# Altium project miniMMC_v2.PrjPcb
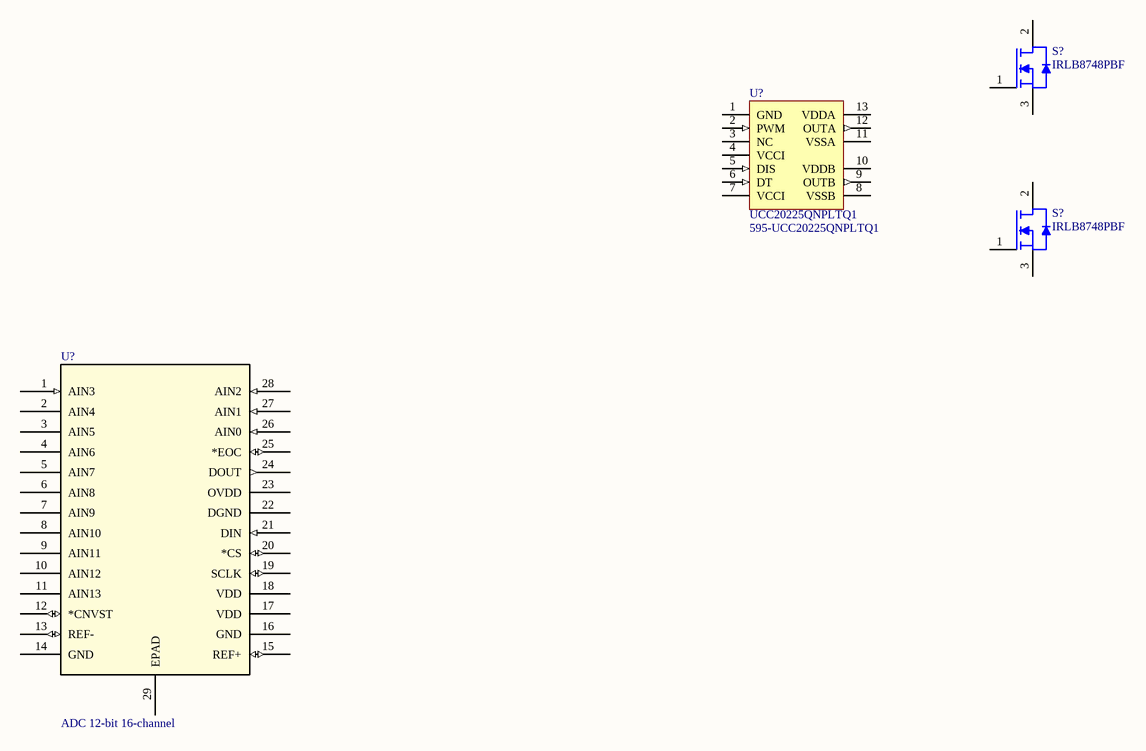
[diagram p0: SM.SchDoc]
1 sheet, 4 parts. Net scope: global (net labels, ports and power ports of the same name join across sheets).

## Sheet SM.SchDoc
size A4

### Parts
(Parts that share a designator on the sheet are numbered #1, #2 ... from top to bottom, then left to right.)
S?#1  IRLB8748PBF  [IRLB8748PBF]
S?#2  IRLB8748PBF  [IRLB8748PBF]
U?#1  UCC20225QNPLTQ1  Supplier Part Number 1: 595-UCC20225QNPLTQ1  [UCC20255-Q1]
U?#2  ADC 12-bit 16-channel  [21-0140L_T285500]

### Nets

Not connected (* = marked no-connect by the designer): S?#1 1 2 3; S?#2 1 2 3; U?#1 1(GND) 2(PWM) 3(NC) 4(VCCI) 5(DIS) 6(DT) 7(VCCI) 8(VSSB) 9(OUTB) 10(VDDB) 11(VSSA) 12(OUTA) 13(VDDA); U?#2 1(AIN3) 2(AIN4) 3(AIN5) 4(AIN6) 5(AIN7) 6(AIN8) 7(AIN9) 8(AIN10) 9(AIN11) 10(AIN12) 11(AIN13) 12(*CNVST) 13(REF-) 14(GND) 15(REF+) 16(GND) 17(VDD) 18(VDD) 19(SCLK) 20(*CS) 21(DIN) 22(DGND) 23(OVDD) 24(DOUT) 25(*EOC) 26(AIN0) 27(AIN1) 28(AIN2) 29(EPAD)

### Library data of the parts
S?#1 S?#2 = IRLB8748PBF: Trans MOSFET N-CH 30V 92A 3-Pin(3+Tab) TO-220AB Tube; Manufacturer: International Rectifier; Rise Time: 96ns; Gate to Source Voltage (Vgs): 20V; Turn-On Delay Time: 14ns; Turn-Off Delay Time: 16ns; Fall Time: 34ns; Input Capacitance: 2.139nF; Max Power Dissipation: 75W; Rds On Max: 4.8mR; Drain to Source Resistance: 6.8mR; Nominal Vgs: 1.8V; Recovery Time: 35ns; Number of Elements: 1; Element Configuration: Single; Supplier 1: Mouser; Supplier Part Number 1: 942-IRLB8748PBF; Manufacturer Part Number: IRLB8748PBF; Stock 1: 3800; Pricing 1: 1 = 0.90000, 10 = 0.77000, 50 = 0.77000, 100 = 0.59200, 1000 = 0.41300, 10000 = 0.41300 (USD); RoHS: Yes; Mount: Through Hole; Case/Package: TO-220AB; Number of Pins: 3; Min Operating Temperature: -55°C; Max Operating Temperature: 175°C; Continuous Drain Current (ID): 92A; Packaging: Rail/Tube; Package Quantity: 50; Drain to Source Breakdown Voltage: 30V; Drain to Source Voltage (Vdss): 30V; Dual Supply Voltage: 30V; Power Dissipation: 75W; Termination: Through Hole; On-State Resistance: 4.8MR; Length: 10.67mm; Height: 16.51mm; Width: 4.83mm; REACH SVHC: No SVHC; Lead Free: Lead Free; ComponentLink1URL: https://datasheet.ciiva.com/14170/irlb8748pbf-eng-tds-14170629.pdf?src-supplier=Distrelec; ComponentLink1Description: https://datasheet.ciiva.com/14170/irlb8748pbf-eng-tds-14170629.pdf?src-supplier=Distrelec; ComponentLink2URL: https://datasheet.ciiva.com/4441/irlb8748pbf-50123-4441243.pdf?src-supplier=Mouser; ComponentLink2Description: https://datasheet.ciiva.com/4441/irlb8748pbf-50123-4441243.pdf?src-supplier=Mouser; ComponentLink3URL: https://datasheet.ciiva.com/26790/irlb8748pbf-26790238.pdf?src-supplier=IIIC; ComponentLink3Description: https://datasheet.ciiva.com/26790/irlb8748pbf-26790238.pdf?src-supplier=IIIC; ComponentLink4URL: https://datasheet.ciiva.com/7870/irlb8748pbf-7870437.pdf?src-supplier=Element14; ComponentLink4Description: https://datasheet.ciiva.com/7870/irlb8748pbf-7870437.pdf?src-supplier=Element14; ComponentLink5URL: https://datasheet.ciiva.com/6371/irlb8748pbf-6371532.pdf?src-supplier=Digi-Key; ComponentLink5Description: https://datasheet.ciiva.com/6371/irlb8748pbf-6371532.pdf?src-supplier=Digi-Key; ComponentLink6URL: https://datasheet.ciiva.com/8116/irlb8748pbf-8116749.pdf?src-supplier=Avnet; ComponentLink6Description: https://datasheet.ciiva.com/8116/irlb8748pbf-8116749.pdf?src-supplier=Avnet
U?#1 = UCC20225QNPLTQ1: Isolated dual-channel gate driver with single input in LGA for automotive 48V systems 13-VLGA -40 to 125; Manufacturer 1: Texas Instruments; Supplier 1: Mouser; Manufacturer Part Number 1: UCC20225QNPLTQ1; Stock 1: 494; Pricing 1: 1=6.93000, 10=6.27000, 25=5.80000, 50=5.80000, 100=5.18000, 250=4.92000, 500=4.51000, 1000=3.93000, 2500=3.78000, 5000=3.50000, 10000=3.93000 (USD); ComponentLink1URL: https://octopart.com/click/track?ai=2118&ct=datasheets&sig=0a87e8a&at=physicalpart&sid=370&ppid=97172364&hlid=26818647&src-supplier=TI+store; ComponentLink1Description: https://octopart.com/click/track?ai=2118&ct=datasheets&sig=0a87e8a&at=physicalpart&sid=370&ppid=97172364&hlid=26818647&src-supplier=TI+store
U?#2 = MAX11136ATI+: Analog to Digital Converters - ADC 500ksps, Low-Power, Serial 12-/10-/8-Bit; Manufacturer: Maxim; Resolution: 12b; Sampling Rate: 500000S/s; Number of A/D Converters: 1; Polarity: Bipolar; Interface: SPI; Max Power Dissipation: 2.76W; Number of Bits: 12; Conversion Rate: 500KS/s; Signal to Noise Ratio (SNR): 72.6dB; Operating Supply Voltage: 3.6V; Supplier 1: Mouser; Supplier Part Number 1: 700-MAX11136ATI+; Manufacturer Part Number: MAX11136ATI+; Stock 1: 178; Pricing 1: 1 = 3.17000, 10 = 3.17000, 50 = 2.75000, 100 = 2.60000, 1000 = 2.60000, 10000 = 2.60000 (USD); RoHS: Yes; Mount: Surface Mount; Number of Pins: 28; Min Operating Temperature: -40°C; Max Operating Temperature: 125°C; Packaging: Rail/Tube; Package Quantity: 60; Number of Converters: 1; Supply Type: Analog; Radiation Hardening: No; ComponentLink1URL: https://datasheet.ciiva.com/14260/max11135-max11143-14260649.pdf?src-supplier=Avnet; ComponentLink1Description: https://datasheet.ciiva.com/14260/max11135-max11143-14260649.pdf?src-supplier=Avnet; ComponentLink2URL: https://datasheet.ciiva.com/14085/max11135-max11143-14085931.pdf?src-supplier=Digi-Key; ComponentLink2Description: https://datasheet.ciiva.com/14085/max11135-max11143-14085931.pdf?src-supplier=Digi-Key